# Altium schematic sheet comms_interface.SchDoc
size A4; SheetNumber: 5; SheetTotal: 7
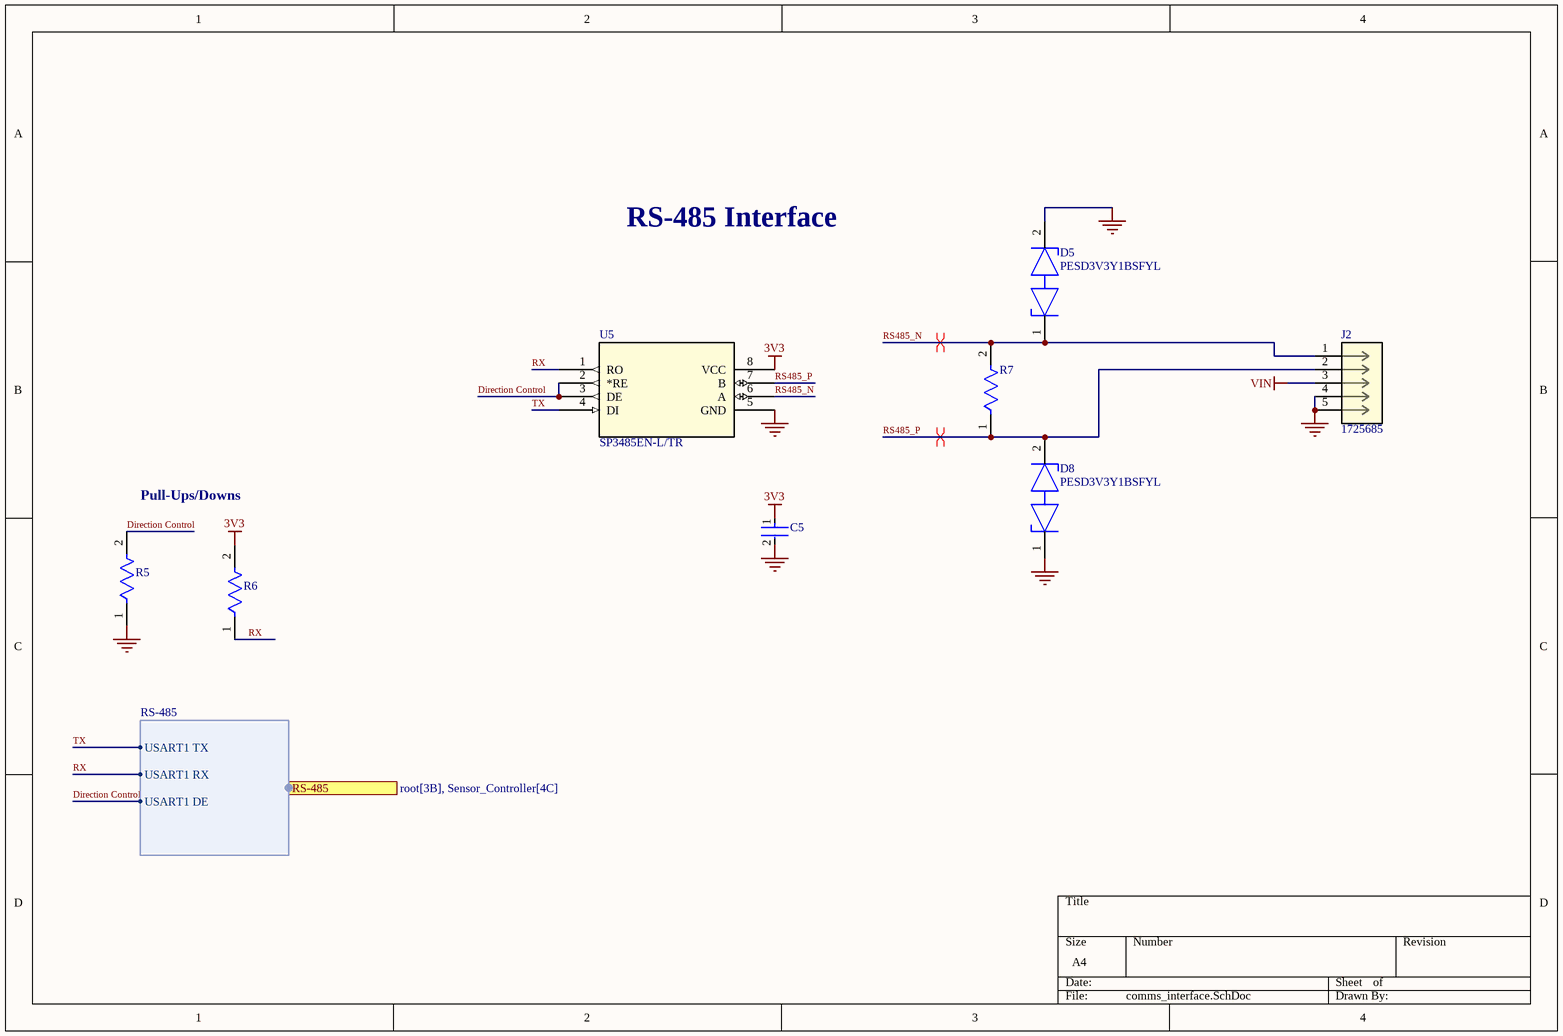
[diagram p0: comms_interface.SchDoc]

## Parts
C5  LMK105B7104KVHF  [FP-0402-L_1_0_0_05-W_0_5-IPC_B]  (value not drawn)
D5  PESD3V3Y1BSFYL  [FP-SOD962-2-CA-MFG]
D8  PESD3V3Y1BSFYL  [FP-SOD962-2-CA-MFG]
J2  1725685  [CONN_1725685_PXC]
R5  AF0402FR-073K3L  [FP-AF0402-IPC_B]  (value not drawn)
R6  AF0402FR-073K3L  [FP-AF0402-IPC_B]  (value not drawn)
R7  AF0402FR-07120RL  [FP-AF0402-IPC_A]  (value not drawn)
U5  SP3485EN-L/TR  [NSOIC-8]

## Ports
RS-485 (harness RS-485, see root[3B], Sensor_Controller[4C])

## Harnesses
RS-485: USART1 TX, USART1 RX, USART1 DE

## Nets
3V3: C5.1 R6.2 U5.8(VCC)
GND: C5.2 D5.2 D8.1 J2.4 J2.5 R5.1 U5.5(GND)
VIN: J2.3
Direction Control: R5.2 U5.2(*RE) U5.3(DE) ; port RS-485.USART1 DE
RS485_N: D5.1 J2.1 R7.2 U5.6(A)
RS485_P: D8.2 J2.2 R7.1 U5.7(B)
RX: R6.1 U5.1(RO) ; port RS-485.USART1 RX
TX: U5.4(DI) ; port RS-485.USART1 TX

## Layout directives
differential pair: RS485_N, RS485_P

## Notes on the sheet
- RS-485 Interface
- Pull-Ups/Downs

## Library data of the parts
C5 = CMP-14477-001294-2: None; Tolerance: 10%; Voltage Rating: 10V; Capacitance: 100nF; Lead Free: Lead Free; Case/Package: 0402; Length: 0.039inch; Thickness: 0.022inch; Halogen Free: Halogen Free; Mount: Surface Mount; Packaging: Tape and Reel; Width: 0.02inch; Case Code (Metric): 1005; Voltage Rating (DC): 10V; Case Code (Imperial): 0402; Min Operating Temperature: -55°C; RoHS Compliant: Yes; Max Operating Temperature: 125°C; Ratings: AEC-Q200
D5 D8 = CMP-11424-92175759-2: PESD3V3Y1BSFYL PESD4V0Y1BSF - Extremely low capacitance bidirectional ESD protection diode; Manufacturer Lifecycle Status: RELEASED FOR SUPPLY; Number of Channels: 1; Breakdown Voltage: 4.2V; Clamping Voltage: 3.7V; Capacitance: 240fF; Reverse Standoff Voltage: 3.3V; Height: 320µm; RoHS: Non-Compliant; Ambient Temperature Range High: 125°C; NexarPartId: 92175759; Direction: Bidirectional; Lifecycle Status: Production; Schedule B: 8536300000
J2 = 1725685: PCB terminal block, nominal current: 6 A, rated voltage (III/2): 160 V, nominal cross section: 0.5 mmÂ², number of potentials: 5, number of rows: 1, number of positions per row: 5, product range: MPT 0,5, pitch: 2.54 mm, connection method: Screw connection with tension sleeve, screw head form: L Slotted, mounting: Wave soldering, conductor/PCB connection direction: 0 Â°, color: green, Pin layout: Linear pinning, Solder pin [P]: 3.5 mm, number of solder pins per potential: 1, type of packaging: packed in cardboard; Manufacturer_Name: Phoenix Contact; Copyright: Copyright (C) 2026 Ultra Librarian. All rights reserved.; Manufacturer_Part_Number: 1725685; RefDes: RefDes; Type: Type
R5 R6 = CMP-03412-043110-1: Anti-Sulfurated Chip Resistors Automotive Grade 3.3kΩ 1% 100ppm/°C 0402; Max Power Dissipation: 63mW; Resistance: 3.3kR; Length: 0.039inch; Min Operating Temperature: -55°C; Case/Package: 0402; Width: 0.02inch; Height: 0.015inch; Resistor Type: Thick Film; Max Operating Temperature: 155°C; Temperature Coefficient: 100ppm/°C; RoHS Compliant: Yes; Features: Moisture Resistant; Series: AF; Number of Terminations: 2; Tolerance: 1%; Packaging: Tape and Reel
R7 = CMP-03412-046039-1: Anti-Sulfurated Chip Resistors Automotive Grade 120Ω 1% 100ppm/°C 0402; Resistance: 120R; Max Power Dissipation: 63mW; RoHS Compliant: Yes; Resistor Type: Thick Film; Length: 0.039inch; Case/Package: 0402; Temperature Coefficient: 100ppm/°C; Number of Terminations: 2; Packaging: Tape and Reel; Min Operating Temperature: -55°C; Height: 0.015inch; Tolerance: 1%; Max Operating Temperature: 155°C; Features: Moisture Resistant; Width: 0.02inch; Series: AF
U5 = SP3485EN-LTR: No Description Available; Manufacturer_Name: MaxLinear / Exar; Copyright: Copyright (C) 2026 Ultra Librarian. All rights reserved.; Manufacturer_Part_Number: SP3485EN-L/TR; RefDes: RefDes; Type: Type